# EAGLE design Qwiic-USB_Hub (EAGLE 9.6.2)
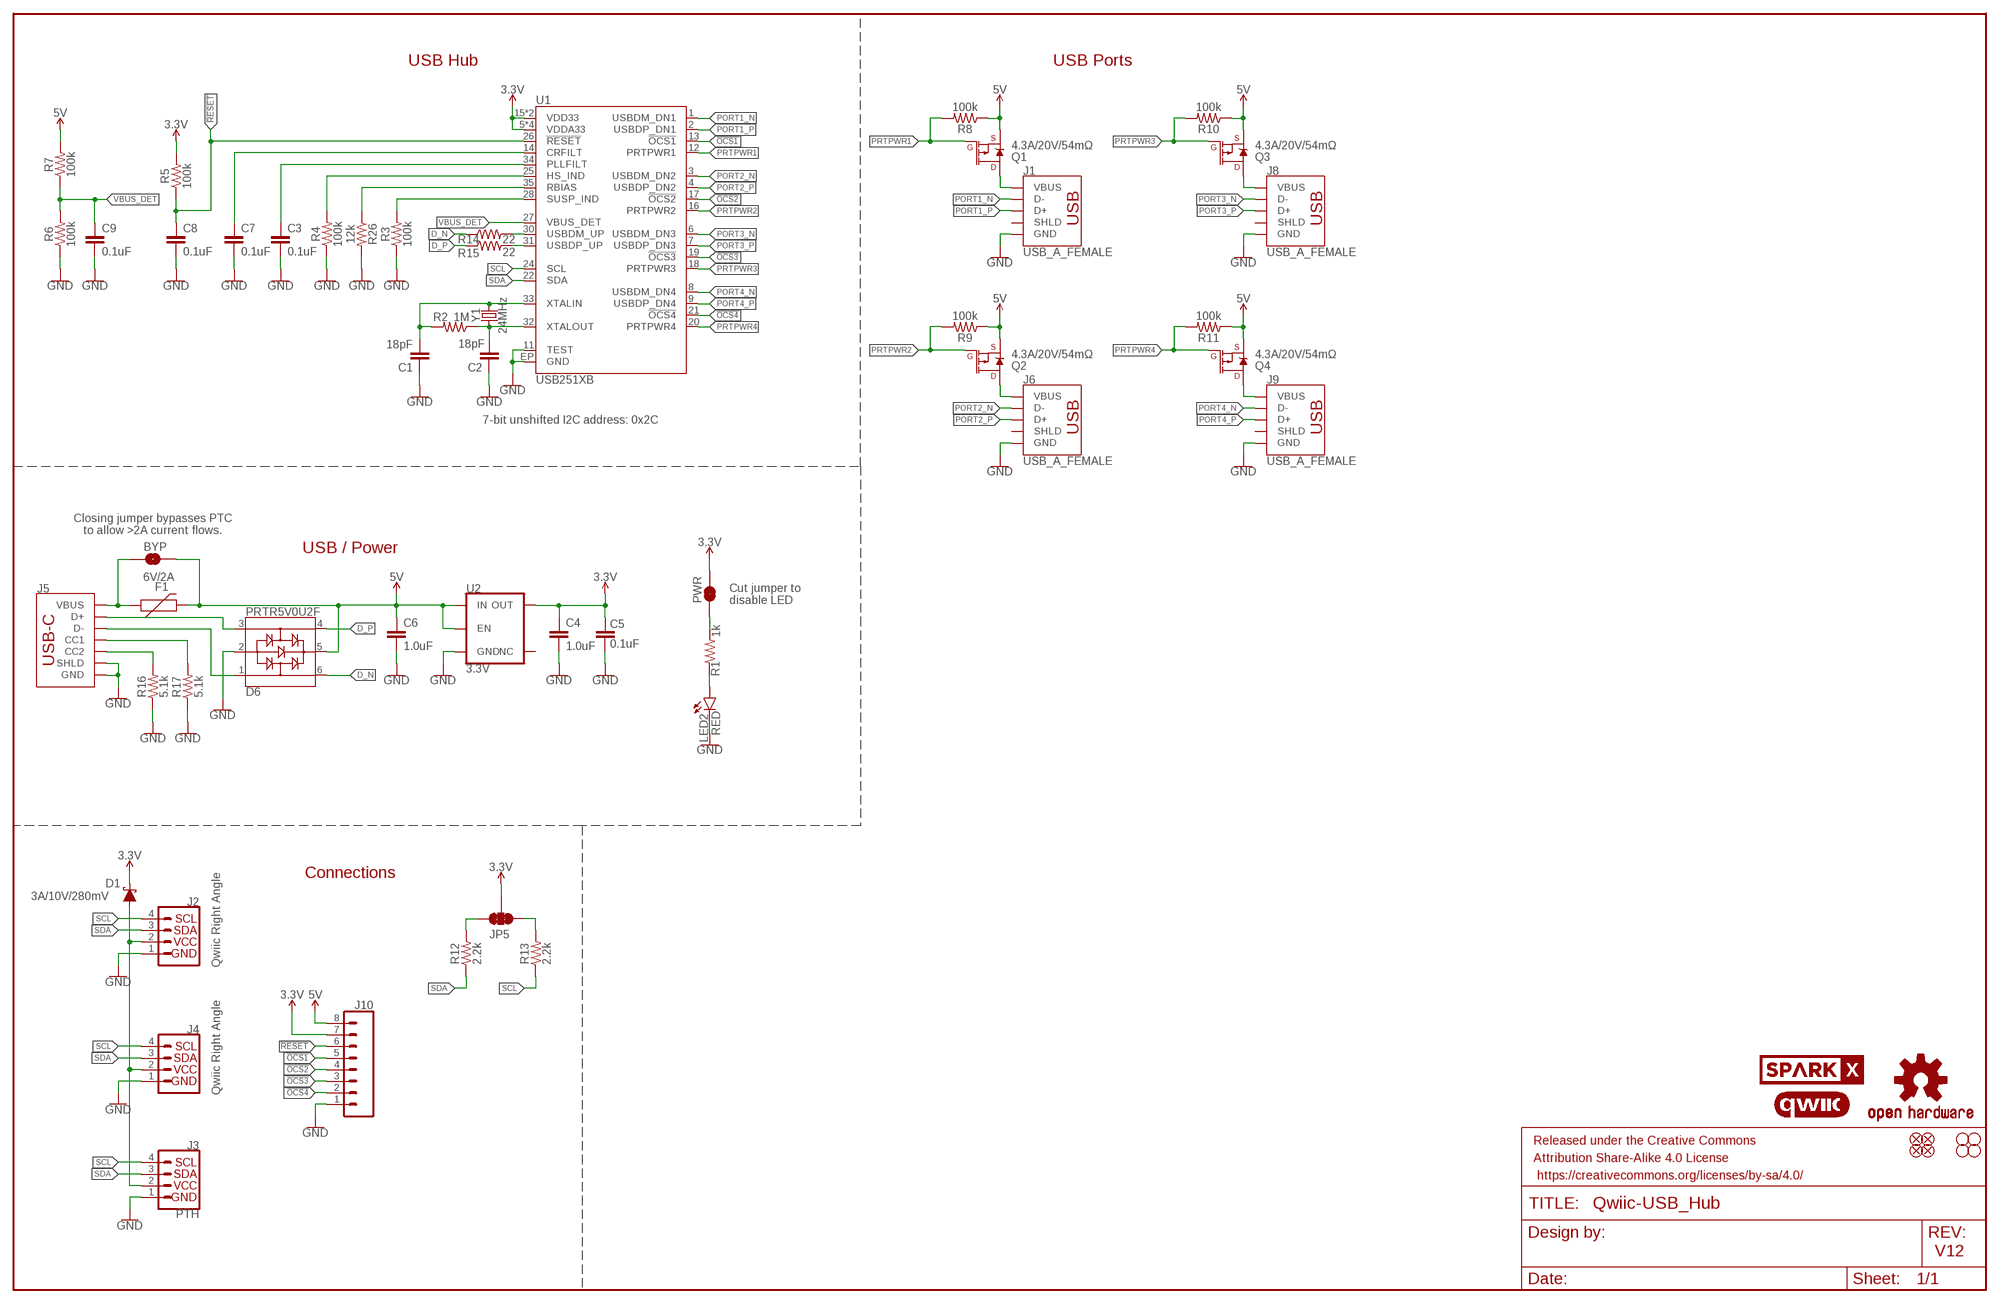
[diagram p0: schematic, sheet 1]

## Parts
BYP  JUMPER-SMT_2_NO_SILK  [SMT-JUMPER_2_NO_SILK]
C1  18pF  18PF-0603-50V-5%  [0603]
C2  18pF  18PF-0603-50V-5%  [0603]
C3  0.1uF  0.1UF-0603-25V-5%  [0603]
C4  1.0uF  1.0UF-0603-16V-10%-X7R  [0603]
C5  0.1uF  0.1UF-0603-25V-5%  [0603]
C6  1.0uF  1.0UF-0603-16V-10%-X7R  [0603]
C7  0.1uF  0.1UF-0603-25V-5%  [0603]
C8  0.1uF  0.1UF-0603-25V-5%  [0603]
C9  0.1uF  0.1UF-0603-25V-5%  [0603]
D1  3A/10V/280mV  DIODE-SCHOTTKY-BAT60A  [SOD-323]
D6  PRTR5V0U2F  [SOT886]
F1  6V/2A  PPTC_6V2A  [1210]
FRAME2  FRAME-LEDGER  [CREATIVE_COMMONS]
J1  USB_A_FEMALE  USB_A_SMT_FEMALE_NS  [USB-A-S-NOSILK-FEMALE]
J2  Qwiic Right Angle  I2C_STANDARDQWIIC  [JST04_1MM_RA]
J3  PTH  I2C_STANDARD_NO_SILK  [1X04_NO_SILK]
J4  Qwiic Right Angle  I2C_STANDARDQWIIC  [JST04_1MM_RA]
J5  USB_C_2-LAYER_PADS  [USB-C-16P-2LAYER-PADS]
J6  USB_A_FEMALE  USB_A_SMT_FEMALE_NS  [USB-A-S-NOSILK-FEMALE]
J8  USB_A_FEMALE  USB_A_SMT_FEMALE_NS  [USB-A-S-NOSILK-FEMALE]
J9  USB_A_FEMALE  USB_A_SMT_FEMALE_NS  [USB-A-S-NOSILK-FEMALE]
J10  CONN_08NO_SILK_FEMALE_PTH  [1X08_NO_SILK]
JP5  JUMPER-SMT_3_2-NC_TRACE_SILK  [SMT-JUMPER_3_2-NC_TRACE_SILK]
JP21  FIDUCIALUFIDUCIAL  [MICRO-FIDUCIAL]
JP31  STAND-OFF  [STAND-OFF]
JP41  STAND-OFF  [STAND-OFF]
JP61  FIDUCIALUFIDUCIAL  [MICRO-FIDUCIAL]
JP71  FIDUCIALUFIDUCIAL  [MICRO-FIDUCIAL]
JP81  FIDUCIALUFIDUCIAL  [MICRO-FIDUCIAL]
JP91  STAND-OFF  [STAND-OFF]
JP101  STAND-OFF  [STAND-OFF]
LED2  RED  LED-RED0603  [LED-0603]
LOGO1  OSHW-LOGOMINI  [OSHW-LOGO-MINI]
LOGO2  QWIIC_LOGO_CONNECTOR  [QWIIC_5.5MM]
PWR  JUMPER-SMT_2_NC_TRACE_SILK  [SMT-JUMPER_2_NC_TRACE_SILK]
Q1  4.3A/20V/54mΩ  MOSFET_PCH-IRLML2244  [SOT23-3]
Q2  4.3A/20V/54mΩ  MOSFET_PCH-IRLML2244  [SOT23-3]
Q3  4.3A/20V/54mΩ  MOSFET_PCH-IRLML2244  [SOT23-3]
Q4  4.3A/20V/54mΩ  MOSFET_PCH-IRLML2244  [SOT23-3]
R1  1k  1KOHM-0603-1/10W-1%  [0603]
R2  1M  1MOHM-0603-1/4W-5%  [0603]
R3  100k  100KOHM-0603-1/10W-1%  [0603]
R4  100k  100KOHM-0603-1/10W-1%  [0603]
R5  100k  100KOHM-0603-1/10W-1%  [0603]
R6  100k  100KOHM-0603-1/10W-1%  [0603]
R7  100k  100KOHM-0603-1/10W-1%  [0603]
R8  100k  100KOHM-0603-1/10W-1%  [0603]
R9  100k  100KOHM-0603-1/10W-1%  [0603]
R10  100k  100KOHM-0603-1/10W-1%  [0603]
R11  100k  100KOHM-0603-1/10W-1%  [0603]
R12  2.2k  2.2KOHM-0603-1/10W-1%  [0603]
R13  2.2k  2.2KOHM-0603-1/10W-1%  [0603]
R14  22  22OHM-0603-1/10W-1%  [0603]
R15  22  22OHM-0603-1/10W-1%  [0603]
R16  5.1k  5.1KOHM5.1KOHM-0603-1/10W-1%  [0603]
R17  5.1k  5.1KOHM5.1KOHM-0603-1/10W-1%  [0603]
R26  12k  12KOHM-0603-1/10W-1%  [0603]
U1  USB251XB  [QFN-36]
U2  3.3V  V_REG_AP2112K-3.3V  [SOT23-5]
U$5  SPARKX-LOGO4  [SPARKX-MEDIUM]
Y1  24MHz  CRYSTAL-24MHZ-SMD-2.0X1.6MM  [CRYSTAL-SMD-2.0X1.6MM]

## Nets
3.3V [3.3V]: C4.1 C5.2 D1.C J10.7 JP5.2 PWR.2 R5.2 U1.5(VDDA33) U1.10(VDDA33) U1.15(VDD33) U1.23(VDD33) U1.29(VDDA33) U1.36(VDDA33) U2.5(OUT)
5V: BYP.2 C6.1 D6.5 F1.2 J10.8 Q1.2(S) Q2.2(S) Q3.2(S) Q4.2(S) R7.2 R8.1 R9.1 R10.1 R11.1 U2.1(IN) U2.3(EN)
!OCS1: J10.5 U1.13(!OCS1)
!OCS2: J10.4 U1.17(!OCS2)
!OCS3: J10.3 U1.19(!OCS3)
!OCS4: J10.2 U1.21(!OCS4)
!RESET: C8.1 J10.6 R5.1 U1.26(!RESET)
CC1: J5.A5(CC1) R17.2
CC2: J5.B5(CC2) R16.2
D_N: D6.6 R14.1
D_P: D6.4 R15.1
GND: C1.1 C2.1 C3.2 C4.2 C5.1 C6.2 C7.2 C8.2 C9.2 D6.2 J1.GND J2.1 J3.1(GND) J4.1 J5.GND J5.GND2(GND) J5.SHLD1(SHLD) J5.SHLD2(SHLD) J5.SHLD3(SHLD) J5.SHLD4(SHLD) J6.GND J8.GND J9.GND J10.1 LED2.C R3.1 R4.1 R6.1 R16.1 R17.1 R26.2 U1.11(TEST) U1.EP(GND) U2.2(GND)
N$1: J1.VBUS Q1.3(D)
N$2: J6.VBUS Q2.3(D)
N$3: J8.VBUS Q3.3(D)
N$4: J9.VBUS Q4.3(D)
N$5: R26.1 U1.35(RBIAS)
N$6: C1.2 R2.2 U1.33(XTALIN) Y1.3
N$7: BYP.1 F1.1 J5.VBUS1(VBUS) J5.VBUS2(VBUS)
N$8: C2.2 R2.1 U1.32(XTALOUT) Y1.1
N$9: JP5.1 R13.2
N$10: LED2.A R1.1
N$11: R3.2 U1.28(SUSP_IND)
N$12: R4.2 U1.25(HS_IND)
N$13: C3.1 U1.34(PLLFILT)
N$14: C7.1 U1.14(CRFILT)
N$15: JP5.3 R12.2
N$16: R14.2 U1.30(USBDM_UP)
N$17: PWR.1 R1.2
N$18: R15.2 U1.31(USBDP_UP)
N$21 [3.3V]: D1.A J2.2 J3.2(VCC) J4.2
PORT1_N: J1.D- U1.1(USBDM_DN1)
PORT1_P: J1.D+ U1.2(USBDP_DN1)
PORT2_N: J6.D- U1.3(USBDM_DN2)
PORT2_P: J6.D+ U1.4(USBDP_DN2)
PORT3_N: J8.D- U1.6(USBDM_DN3)
PORT3_P: J8.D+ U1.7(USBDP_DN3)
PORT4_N: J9.D- U1.8(USBDM_DN4)
PORT4_P: J9.D+ U1.9(USBDP_DN4)
PRTPWR1: Q1.1(G) R8.2 U1.12(PRTPWR1)
PRTPWR2: Q2.1(G) R9.2 U1.16(PRTPWR2)
PRTPWR3: Q3.1(G) R10.2 U1.18(PRTPWR3)
PRTPWR4: Q4.1(G) R11.2 U1.20(PRTPWR4)
SCL: J2.4 J3.4(SCL) J4.4 R13.1 U1.24(SCL)
SDA: J2.3 J3.3(SDA) J4.3 R12.1 U1.22(SDA)
UNP_D+: D6.3 J5.A6(D+) J5.B6(D+)
UNP_D-: D6.1 J5.A7(D-) J5.B7(D-)
VBUS_DET: C9.1 R6.2 R7.1 U1.27(VBUS_DET)
Unconnected: J1.SHLD1(SHLD) J1.SHLD2(SHLD) J6.SHLD1(SHLD) J6.SHLD2(SHLD) J8.SHLD1(SHLD) J8.SHLD2(SHLD) J9.SHLD1(SHLD) J9.SHLD2(SHLD) U2.4(NC)

## Notes on the sheet
- USB Hub | USB Ports
- 7-bit unshifted I2C address: 0x2C
- Closing jumper bypasses PTC
  to allow >2A current flows.
- USB / Power
- Cut jumper to 
  disable LED
- Connections
- V12

## Library data of the parts
BYP = SparkFun-Jumpers:JUMPER-SMT_2_NO: Normally open jumper This jumper has two pads in close proximity to each other. Apply solder to close the connection. Round pads are easier to solder for beginners, but are a lot larger. SparkFun Product that uses the round pads: SparkFun EL Sequencer <https://www.sparkfun.com/products/12781>
C1 C2 = SparkFun-Capacitors:18PF: 18pF ceramic capacitors A capacitor is a passive two-terminal electrical component used to store electrical energy temporarily in an electric field.; PROD_ID: CAP-08267
C3 C5 C7-C9 = SparkFun-Capacitors:0.1UF: 0.1µF ceramic capacitors A capacitor is a passive two-terminal electrical component used to store electrical energy temporarily in an electric field.; PROD_ID: CAP-08604
C4 C6 = SparkFun-Capacitors:1.0UF: 1µF ceramic capacitors A capacitor is a passive two-terminal electrical component used to store electrical energy temporarily in an electric field.; PROD_ID: CAP-13930
D1 = SparkFun-DiscreteSemi:DIODE-SCHOTTKY: Schottky diode A Schottky diode is a semiconductor diode which has a low forward voltage drop and a very fast switching action.; PROD_ID: DIO-14072
D6 = SparkFun-IC-Power:PRTR5V0U2: A small ESD protection device. Most commonly used on USB D+/D- signals to protect large, expensive, or especially sensitive USB enabled devices.; PROD_ID: DIO-14084
F1 = SparkFun-Fuses:PPTC: Resettable Fuse PPTC Resettable Fuse. Really a sort of resistor with a polymeric positive temperature coefficient whose resistance increases dramatically with an increase in temperature. When heated by the power passing through the resistance rises causing the current to be limited, protecting the circuit. This is achieved by the transition of the polymer from a crystalline to an amorphous state where the conductive carbon separates breaking the conductive pathways found in the cool crystalline structure. When a PPTC cools back down it resumes conducting letting the circuit turn back on. SparkFun Products: SparkFun RedBoard - Programmed with Arduino <https://www.sparkfun.com/products/12757> Pro Micro - 5V/16MHz <https://www.sparkfun.com/products/12640> Arduino Pro 328 - 5V/16MHz <https://www.sparkfun.com/products/10915> MP3 Trigger <https://www.sparkfun.com/products/13720>; PROD_ID: RES-14313
FRAME2 = SparkFun-Aesthetics:FRAME-LEDGER: Schematic Frame - Ledger Standard 11x14 US Ledger frame
J1 J6 J8 J9 = SparkFun-Connectors:USB_A: USB-A Connector Male and female variants, as well as PTH and SMT variants SparkFun Products: SparkFun XBee Explorer Dongle <https://www.sparkfun.com/products/11697> PTH Male SparkFun MicroView-USB Programmer <https://www.sparkfun.com/products/12924> SMT Male SparkFun USB Type A Female Breakout <https://www.sparkfun.com/products/12700> SMT Female; PROD_ID: CONN-09520; SF_ID: PRT-09011
J2 J4 = SparkFun-Connectors:I2C_STANDARD: SparkFun I2C Standard Pinout Header SparkFun has standardized on a pinout for all I2C based sensor breakouts. This pinout allows I2C boards to be plugged directly into the headers on Arduino Uno compatible boards, and to be daisy chained easily. Example SparkFun Products: SparkFun Atmospheric Sensor Breakout - BME280 <https://www.sparkfun.com/products/13676> SparkFun Altitude/Pressure Sensor Breakout - MPL3115A2 <https://www.sparkfun.com/products/11084> SparkFun TOF Range Finder Sensor - VL6180 <https://www.sparkfun.com/products/12785>; PROD_ID: CONN-13694
J3 = SparkX:I2C_STANDARD: SparkFun I2C Standard Pinout Header SparkFun has standardized on a pinout for all I2C based sensor breakouts. This pinout allows I2C boards to be plugged directly into the headers on Arduino Uno compatible boards, and to be daisy chained easily. Example SparkFun Products: SparkFun Atmospheric Sensor Breakout - BME280 <https://www.sparkfun.com/products/13676> SparkFun Altitude/Pressure Sensor Breakout - MPL3115A2 <https://www.sparkfun.com/products/11084> SparkFun TOF Range Finder Sensor - VL6180 <https://www.sparkfun.com/products/12785>
J5 = SparkFun-Connectors:USB_C: USB Type C 16Pin Connector Super Speed pins not available on the 16-pin purely SMD connector so this part is best for USB 2.0 implementations. D1 and D2 are tied together enabling D+/- no matter which way the cable is plugged into the connector. The two channel configuration pins (CC1/2) are exposed. These are normally connected to ground via 5.1k resistors but can be reconfigured for high current/high power applications. **4-LAYER BOARD WARNING!!** If designing 4-layer board, make sure to select the variant _4-LAYER-ISOLATED. The linked footprint (USB-C-16-4LAYER-ISOLATED) includes some very necessary cutout polygons in the inner layers (2 and 15). This prevents the PTH mounting shield legs on the USB connector from electrically connecting any other polygons on the inner layers (usually VCC and GND).; PROD_ID: CONN-14122
J10 = SparkFun-Connectors:CONN_08: Multi connection point. Often used as Generic Header-pin footprint for 0.1 inch spaced/style header connections On any of the 0.1 inch spaced packages, you can populate with these: Break Away Headers - Straight <https://www.sparkfun.com/products/116> (PRT-00116) Break Away Male Headers - Right Angle <https://www.sparkfun.com/products/553> (PRT-00553) Female Headers <https://www.sparkfun.com/products/115> (PRT-00115) Break Away Headers - Machine Pin <https://www.sparkfun.com/products/117> (PRT-00117) Break Away Female Headers - Swiss Machine Pin <https://www.sparkfun.com/products/743> (PRT-00743) Arduino Stackable Header - 8 Pin <https://www.sparkfun.com/products/9279> (PRT-09279) For SCREWTERMINALS and SPRING TERMINALS visit here: Screw Terimnals on SparkFun.com <https://www.sparkfun.com/search/results?term=Screw+Terminals> (5mm/3.5mm/2.54mm spacing) This device is also useful as a general connection point to wire up your design to another part of your project. Our various solder wires solder well into these plated through hole pads. Hook-Up Wire - Assortment (Stranded, 22 AWG) <https://www.sparkfun.com/products/11375> (PRT-11375) Hook-Up Wire - Assortment (Solid Core, 22 AWG) <https://www.sparkfun.com/products/11367> (PRT-11367) View the entire wire category on our website here <https://www.sparkfun.com/categories/141> Special notes: Molex polarized connector foot print use with SKU : PRT-08231 with associated crimp pins and housings. 1MM SMD Version SKU: PRT-10208 NOTES ON THE VARIANTS LOCK and LOCK_LONGPADS... This footprint was designed to help hold the alignment of a through-hole component (i.e. 6-pin header) while soldering it into place. You may notice that each hole has been shifted either up or down by 0.005 of an inch from it's more standard position (which is a perfectly straight line). This slight alteration caused the pins (the squares in the middle) to touch the edges of the holes. Because they are alternating, it causes a "brace" to hold the component in place. 0.005 has proven to be the perfect amount of "off-center" position when using our standard breakaway headers. Although looks a little odd when you look at the bare footprint, once you have a header in there, the alteration is very hard to notice. Also,if you push a header all the way into place, it is covered up entirely on the bottom side.; PROD_ID: CONN-08438
JP5 = SparkFun-Jumpers:JUMPER-SMT_3_2-NC_TRACE: Normally closed trace jumper (2 of 2 connections) This jumper has a trace between all three pads so they are normally closed (NC). Use a razor knife to open the connection(s). For best results follow the IPC guidelines for cutting traces: Cutout at least 0.063 mm (0.005 in). Remove all loose material to clean up the cut area. Seal the cut with an approved epoxy. Reapply solder to reclose the connection(s).
JP21 JP61 JP71 JP81 = SparkFun:FIDUCIAL: Fiducial Alignment Points Various fiducial points for machine vision alignment.
JP31 JP41 JP91 JP101 = SparkFun:STAND-OFF: Stand Off This is the mechanical footprint for a #4 phillips button head screw. Use the keepout ring to avoid running the screw head into surrounding components. SKU : PRT-00447
LED2 = SparkFun-LED:LED-RED: Red SMD LED Used in manufacturing of most products at SparkFun Packages: 0603 - SMD 0603 package [Product Link] <http://docs.avagotech.com/docs/AV02-0551EN> 0603 SMART - SMD 0603 SMART package ( more efficient and expensive)[Product Link] <http://www.osram-os.com/Graphics/XPic2/00077099_0.pdf> 1206 - SMD1206 package [Product Link] <https://www.sparkfun.com/datasheets/DevTools/LilyPad/Q150OVS4.pdff> SparkFun Products: Pro Mini 328 -5V <https://www.sparkfun.com/products/821> RedBoard <https://www.sparkfun.com/products/12757> IOIO-OTG <https://www.sparkfun.com/products/13613>; PROD_ID: DIO-00819
LOGO1 = SparkFun-Aesthetics:OSHW-LOGO: Open-Source Hardware (OSHW) Logo This logo indicates the piece of hardware it is found on incorporates a OSHW license and/or adheres to the definition of open source hardware found here: http://freedomdefined.org/OSHW
LOGO2 = SparkFun-Aesthetics:QWIIC_LOGO: Qwiic Logos for placement on schematic and PCB. The 5.5mm silk logo is best for placing next to Qwiic connector.
PWR = SparkFun-Jumpers:JUMPER-SMT_2_NC_TRACE: Normally closed trace jumper This jumper has a trace between two pads so it's normally closed (NC). Use a razor knife to open the connection. For best results follow the IPC guidelines for cutting traces: Cutout at least 0.063 mm (0.005 in). Remove all loose material to clean up the cut area. Seal the cut with an approved epoxy. Reapply solder to reclose the connection.
Q1-Q4 = SparkFun-DiscreteSemi:MOSFET_PCH: P-channel MOSFETs Voltage controlled devices that allow control of high current outputs. SparkFun Products: SparkFun ESP32 Thing <https://www.sparkfun.com/products/13907> SparkFun ESP8266 Thing <https://www.sparkfun.com/products/13231> SparkFun Pi Servo HAT V2 <https://www.sparkfun.com/products/15316> DMG2305UX-7 (20V/4.2A/SOT23-3); PROD_ID: TRANS-11153
R1 = SparkFun-Resistors:1KOHM: 1kΩ resistor A resistor is a passive two-terminal electrical component that implements electrical resistance as a circuit element. Resistors act to reduce current flow, and, at the same time, act to lower voltage levels within circuits. - Wikipedia; PROD_ID: RES-07856
R2 = SparkFun-Resistors:1MOHM: 1MΩ resistor A resistor is a passive two-terminal electrical component that implements electrical resistance as a circuit element. Resistors act to reduce current flow, and, at the same time, act to lower voltage levels within circuits. - Wikipedia; PROD_ID: RES-07868
R3-R11 = SparkFun-Resistors:100KOHM: 100kΩ resistor A resistor is a passive two-terminal electrical component that implements electrical resistance as a circuit element. Resistors act to reduce current flow, and, at the same time, act to lower voltage levels within circuits. - Wikipedia; PROD_ID: RES-07828
R12 R13 = SparkFun-Resistors:2.2KOHM: 2.2kΩ resistor A resistor is a passive two-terminal electrical component that implements electrical resistance as a circuit element. Resistors act to reduce current flow, and, at the same time, act to lower voltage levels within circuits. - Wikipedia; PROD_ID: RES-08272
R14 R15 = SparkFun-Resistors:22OHM: 22Ω resistor A resistor is a passive two-terminal electrical component that implements electrical resistance as a circuit element. Resistors act to reduce current flow, and, at the same time, act to lower voltage levels within circuits. - Wikipedia; PROD_ID: RES-08698
R16 R17 = SparkFun-Resistors:5.1KOHM; PROD_ID: RES-12083
R26 = SparkFun-Resistors:12KOHM: 12kΩ resistor A resistor is a passive two-terminal electrical component that implements electrical resistance as a circuit element. Resistors act to reduce current flow, and, at the same time, act to lower voltage levels within circuits. - Wikipedia; PROD_ID: RES-10327
U1 = USB251xB:USB251XB; PROD_ID: IC-15827
U2 = SparkFun-IC-Power:V_REG_AP2112: AP2112 - 600mA CMOS LDO Regulator w/ Enable The AP2112 is CMOS process low dropout linear regulator with enable function, the regulator delivers a guaranteed 600mA (min.) continuous load current. Features Output Voltage Accuracy: ±1.5% Output Current: 600mA (Min.) Foldback Short Current Protection: 50mA Enable Function to Turn ON/OFF VOUT Low Dropout Voltage (3.3V): 250mV (Typ.) @IOUT=600mA Excellent Load Regulation: 0.2%/A (Typ.) Excellent Line Regulation: 0.02%/V (Typ.) Low Quiescent Current: 55μA (Typ.) Low Standby Current: 0.01μA (Typ.) Low Output Noise: 50μVRMS PSRR: 100Hz -65dB, 1kHz -65dB OTSD Protection Stable with 1.0μF Flexible Cap: Ceramic, Tantalum and Aluminum Electrolytic Operation Temperature Range: -40°C to 85°C ESD: MM 400V, HBM 4000V; PROD_ID: VREG-12457
U$5 = SparkX:SPARKX-LOGO
Y1 = SparkFun-Clocks:CRYSTAL-24MHZ: 24MHz Crystal Datasheet <http://www.sparkfun.com/datasheets/Components/AT-SMD-5x3.pdf> Frequency: 24MHz Frequency Tolerance: ±20ppm Load Capacitance: 12pF SparkFun Products: USB Bit Whacker <https://www.sparkfun.com/products/762>; PROD_ID: XTAL-14845

## Net classes
1 power: width 0.178 mm
2 3.3V: width 0.305 mm
3 RF: width 0.35 mm, clearance 0.203 mm

## Board
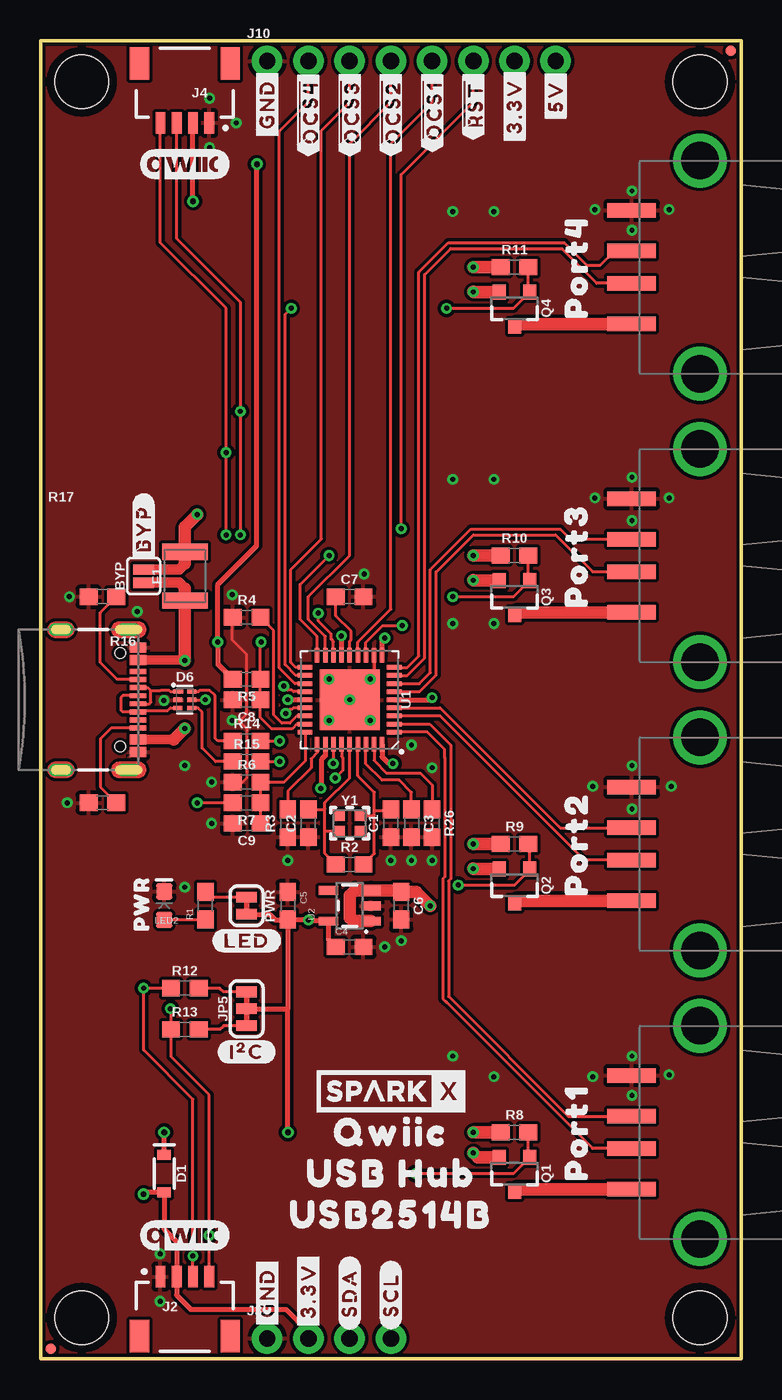
[diagram p1: board, top side]
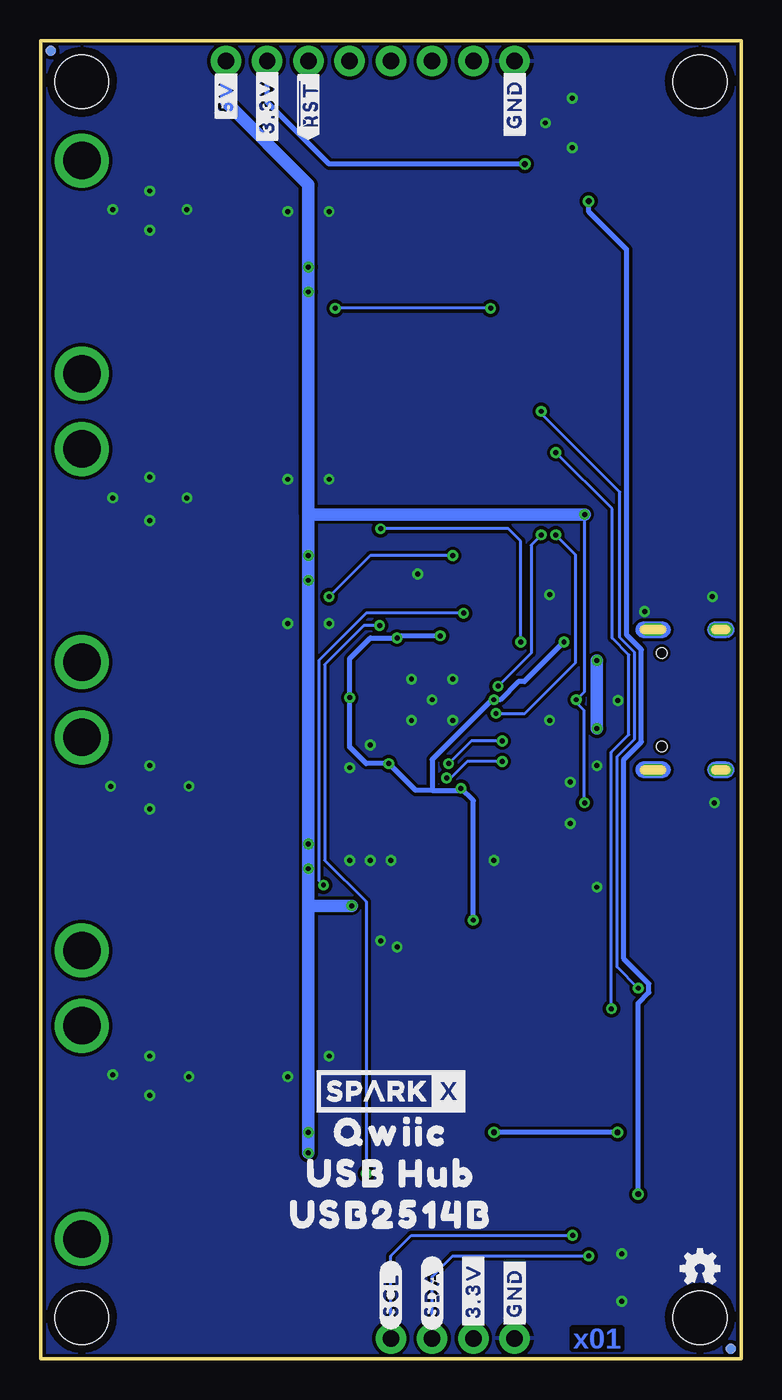
[diagram p2: board, bottom side, seen from below]

Size 43.18 x 81.28 mm. Coordinates in mm from the lower left corner, seen from the top.
Outline: 43.18,0 0,0 0,81.28 43.18,81.28 43.18,0
Copper layers (1*16): Top 0.035mm / dielectric 1.5mm / Bottom 0.035mm
Design rules "SparkFun-2-Layer-General-JLCPCB": minimum track width 7mil, minimum drill 0.3mm, track to track 7mil, track to pad 7mil, pad to pad 7mil, via to via 7mil, smd to smd 7mil, copper to edge 7mil, drill to drill 7mil, minimum pad ring 7mil, minimum via ring 7mil, stop-mask expansion 4mil, vias tented up to drill 25mil, thermal gap 10mil

### Footprints (pad centres in the part's own frame; a part is rotated, then mirrored left to right if it is on the bottom)
SMT-JUMPER_2_NO_SILK = smd 0.635 x 1.27: 1 -0.406,0; 2 0.406,0
0603 = smd 1.1 x 1: 1 -0.85,0; 2 0.85,0
SOD-323 = smd 0.63 x 0.83: A 1.15,0; C -1.15,0
SOT886 = smd 0.61 x 0.25: 1 -0.405,0.5 | smd 0.56 x 0.25: 2 -0.43,0; 3 -0.43,-0.5; 4 0.43,-0.5; 5 0.43,0; 6 0.43,0.5
1210 = smd 1 x 2.8: 1 -1.5,0; 2 1.5,0
USB-A-S-NOSILK-FEMALE = smd 3 x 0.9: D+ 6.752,-1; D- 6.752,1; GND 6.752,-3.5; VBUS 6.752,3.5 | drill 2.311: SHLD1 2.54,-6.566; SHLD2 2.54,6.566
JST04_1MM_RA = smd 0.6 x 1.35: 1 -1.5,0; 2 -0.5,0; 3 0.5,0; 4 1.5,0 | smd 1.2 x 2: NC1 2.8,-3.675; NC2 -2.8,-3.675
1X04_NO_SILK = drill 1.016 pad 1.88: 1 0,0; 2 2.54,0; 3 5.08,0; 4 7.62,0
USB-C-16P-2LAYER-PADS = smd 0.3 x 1: A5 -1.25,-0.34; A6 -0.25,-0.34; A7 0.25,-0.34; A8 1.25,-0.34; B5 1.75,-0.34; B6 0.75,-0.34; B7 -0.75,-0.34; B8 -1.75,-0.34 | smd 0.6 x 1: GND -3.225,-0.34; GND2 3.225,-0.34; VBUS1 -2.45,-0.34; VBUS2 2.45,-0.34 | drill 0.4 pad 0.6 long: SHLD1 -4.318,-0.915; SHLD2 4.318,-0.915; SHLD3 -4.318,-5.095; SHLD4 4.318,-5.095 | hole 0.65: -2.89,-1.445; 2.89,-1.445
1X08_NO_SILK = drill 1.016 pad 1.88: 1 0,0; 2 2.54,0; 3 5.08,0; 4 7.62,0; 5 10.16,0; 6 12.7,0; 7 15.24,0; 8 17.78,0
SMT-JUMPER_3_2-NC_TRACE_SILK = smd 0.66 x 1.27: 1 -1.041,0; 2 0,0; 3 1.041,0
MICRO-FIDUCIAL = smd 0.635 x 0.635: 1 0,0
STAND-OFF = hole 3.302: 0,0
LED-0603 = smd 1 x 1: A -0.877,0; C 0.877,0
SMT-JUMPER_2_NC_TRACE_SILK = smd 0.66 x 1.27: 1 -0.521,0; 2 0.521,0
SOT23-3 = smd 0.8 x 0.9: 1 -0.95,-1; 2 0.95,-1; 3 0,1.1
QFN-36 = smd 0.9 x 0.28: 1 -2.75,2; 2 -2.75,1.5; 3 -2.75,1; 4 -2.75,0.5; 5 -2.75,0; 6 -2.75,-0.5; 7 -2.75,-1; 8 -2.75,-1.5; 9 -2.75,-2; 19 2.75,-2; 20 2.75,-1.5; 21 2.75,-1; 22 2.75,-0.5; 23 2.75,0; 24 2.75,0.5; 25 2.75,1; 26 2.75,1.5; 27 2.75,2 | smd 0.28 x 0.9: 10 -2,-2.75; 11 -1.5,-2.75; 12 -1,-2.75; 13 -0.5,-2.75; 14 0,-2.75; 15 0.5,-2.75; 16 1,-2.75; 17 1.5,-2.75; 18 2,-2.75; 28 2,2.75; 29 1.5,2.75; 30 1,2.75; 31 0.5,2.75; 32 0,2.75; 33 -0.5,2.75; 34 -1,2.75; 35 -1.5,2.75; 36 -2,2.75 | smd 3.7 x 3.7: EP 0,0
SOT23-5 = smd 0.55 x 1.2: 1 -0.95,-1.3; 2 0,-1.3; 3 0.95,-1.3; 4 0.95,1.3; 5 -0.95,1.3
CRYSTAL-SMD-2.0X1.6MM = smd 0.75 x 0.7: 1 -0.675,-0.5; 2 0.675,-0.5; 3 0.675,0.5; 4 -0.675,0.5

### Placement (x,y rotation side)
BYP  6.35,48.26 90 top
C1  21.59,33.02 90 top
C2  16.51,33.02 90 top
C3  22.86,33.02 270 top
C4  19.05,25.4 0 top
C5  15.24,27.94 270 top
C6  22.23,27.94 270 top
C7  19.05,46.99 0 top
C8  12.7,40.64 180 top
C9  12.7,33.02 180 top
D1  7.62,11.43 270 top
D6  8.89,40.64 0 top
F1  8.89,48.26 90 top
FRAME2  -17.78,-26.67 0 top  (outside the outline)
J1  43.18,13.97 180 top
J2  8.89,5.08 0 top
J3  13.97,1.27 0 top
J4  8.89,76.2 180 top
J5  6.35,40.64 270 top
J6  43.18,31.75 180 top
J8  43.18,49.53 180 top
J9  43.18,67.31 180 top
J10  13.97,80.01 0 top
JP5  12.7,21.59 90 top
JP21  42.55,80.64 90 top
JP31  2.54,2.54 90 top
JP41  2.54,78.74 90 top
JP61  0.64,0.64 90 top
JP71  42.55,80.64 270 bottom
JP81  0.64,0.64 270 bottom
JP91  40.64,2.54 90 top
JP101  40.64,78.74 90 top
LED2  7.62,27.94 90 top
LOGO1  2.54,5.59 0 bottom
LOGO2  8.89,73.66 0 top
PWR  12.7,27.94 270 top
Q1  29.21,11.43 180 top
Q2  29.21,29.21 180 top
Q3  29.21,46.99 180 top
Q4  29.21,64.77 180 top
R1  10.16,27.94 90 top
R2  19.05,30.48 0 top
R3  15.24,33.02 90 top
R4  12.7,45.72 0 top
R5  12.7,41.91 180 top
R6  12.7,35.56 0 top
R7  12.7,34.29 180 top
R8  29.21,13.97 0 top
R9  29.21,31.75 0 top
R10  29.21,49.53 0 top
R11  29.21,67.31 0 top
R12  8.89,22.86 0 top
R13  8.89,20.32 0 top
R14  12.7,38.1 0 top
R15  12.7,36.83 0 top
R16  3.81,34.29 0 top
R17  3.81,46.99 0 top
R26  24.13,33.02 270 top
U1  19.05,40.64 180 top
U2  19.05,27.94 90 top
U$1  [PORT40]  33.02,67.31 90 top
U$2  [PORT31]  33.02,49.53 90 top
U$3  [PORT22]  33.02,31.75 90 top
U$4  [PORT13]  33.02,13.97 90 top
U$5  21.59,16.51 0 top
U$6  [#3#3V#0]  16.51,4.19 90 bottom
U$7  [#SDA#0]  19.05,4.06 90 bottom
U$8  [#SCL#0]  21.59,3.94 90 bottom
U$9  [#GND#0]  13.97,4.06 90 bottom
U$10  [#I�C#1]  12.7,18.92 0 top
U$11  [#GND#5]  13.97,77.34 90 bottom
U$12  [PWR0]  6.22,28.07 90 top
U$13  [##RST##4]  26.67,77.34 90 top
U$14  [#3#3V#6]  29.21,77.22 90 top
U$15  [#5V#7]  31.75,77.85 90 top
U$16  [#GND#5]  13.97,77.34 90 top
U$17  [##OCS1##3]  24.13,76.96 90 top
U$18  [##OCS2##2]  21.59,76.83 90 top
U$19  [##OCS3##1]  19.05,76.83 90 top
U$20  [##OCS4##0]  16.51,76.83 90 top
U$21  [#BYP#0]  6.35,51.18 90 top
U$22  [QWIIC2]  21.59,13.97 0 top
U$23  [#LED#0]  12.7,25.78 0 top
U$26  [USB2514B0]  21.59,8.89 0 top
U$27  [USB_HUB1]  21.59,11.43 0 top
U$31  [##RST##4]  26.67,77.34 90 bottom
U$32  [#3#3V#6]  29.21,77.22 90 bottom
U$33  [#GND#0]  13.97,4.06 90 top
U$34  [#3#3V#0]  16.51,4.19 90 top
U$35  [#SDA#0]  19.05,4.06 90 top
U$36  [#SCL#0]  21.59,3.94 90 top
U$37  [#5V#7]  31.75,77.85 90 bottom
U$38  SPARKX-LOGO4  [SPARKX-MEDIUM]  21.59,16.51 0 bottom
U$39  [QWIIC2]  21.59,13.97 0 bottom
U$40  [USB_HUB1]  21.59,11.43 0 bottom
U$41  [USB2514B0]  21.59,8.89 0 bottom
U$42  [QWIIC_5.5MM]  8.89,7.62 0 top
Y1  19.05,33.02 0 top

### Tracks (layer width: path | path; a pad name or v marks a point on that pad's centre or on a via)
3.3V  (via drill 0.3, 0.35)
  Top 0.305: C4.1 17.75,25.85 U2.5 16.57,26.99 v16.51,27.05 16.47,27.09 C5.2 15.24,27.05 | U1.23 v15.24,40.64 | v24.13,40.77 24.13,40.64 U1.5 | U1.29 17.55,37.19 17.31,36.95 17.31,35.22 v17.27,35.18 | U1.36 21.05,37.12 21.46,36.7 v21.72,36.7 | U1.10 21.05,44.29 v21.21,44.45 | U1.15 v18.55,44.57 v18.54,44.58 | R5.2 10.92,42.84 v10.92,44.2 10.92,47.75 13.31,50.14 13.31,73.64 v13.34,73.66 | 15.24,27.05 15.24,21.59 | JP5.2 15.24,21.59 | PWR.2 14.11,27.42 14.48,27.05 15.24,27.05 | D1.C v7.62,13.97 | v15.24,13.97 15.24,21.59
  Bottom 0.305: 19.05,35.05 17.4,35.05 v17.27,35.18 16.51,34.42 v16.51,27.05 | 19.05,35.05 20.07,35.05 v21.72,36.7 23.11,36.7 24.13,37.72 v24.13,40.77 24.13,43.18 22.86,44.45 v21.21,44.45 21.08,44.58 v18.54,44.58 | v10.92,44.2 13.36,41.76 13.74,41.76 14.85,40.64 v15.24,40.64 15.37,40.64 19.05,36.96 19.05,35.05 | J10.7 29.21,77.47 25.4,73.66 v13.34,73.66 | v7.62,13.97 v15.24,13.97
5V  (via drill 0.3)
  Top 0.178: D6.5 v10.16,40.64 | R7.2 v9.65,34.29
  Top 0.635: BYP.2 8.53,48.67 8.89,49.02
  Top 0.762: v9.65,52.07 9.65,52.05 8.89,51.28 F1.2 8.89,49.02 | R8.1 v26.67,13.97 | Q1.2 26.94,12.43 v26.67,12.7 | Q2.2 26.69,30.21 v26.67,30.23 | R9.1 v26.67,31.75 | R10.1 v26.67,49.53 | Q3.2 26.69,47.99 v26.67,48.01 | R11.1 v26.67,67.31 | Q4.2 26.69,65.77 v26.67,65.79 | v24,27.94 23.15,28.79 C6.1 22.12,28.89 U2.3 19.36,28.89 19.05,28.57 19.05,27.18 19.24,26.99 U2.1
  Bottom 0.178: 10.03,52.07 9.65,51.69 9.65,41.15 v10.16,40.64 10.16,40.47 9.69,40 9.69,34.33 v9.65,34.29
  Bottom 0.762: v9.65,52.07 10.03,52.07 26.67,52.07 | 26.67,52.07 v26.67,49.53 v26.67,48.01 v26.67,31.75 v26.67,30.23 26.67,27.94 | 26.67,27.94 v26.67,13.97 v26.67,12.7 | 26.67,52.07 v26.67,65.79 v26.67,67.31 26.67,72.39 31.75,77.47 J10.8 | v24,27.94 26.67,27.94
!OCS1
  Top 0.178: U1.13 19.55,44.19 21.59,46.23 21.59,74.93 24.13,77.47 J10.5
!OCS2
  Top 0.178: U1.17 17.55,44.55 16.51,45.59 16.51,46.99 19.05,49.53 19.05,74.93 21.59,77.47 J10.4
!OCS3
  Top 0.178: U1.19 15.74,42.64 15.43,42.95 15.43,48.67 17.31,50.55 17.31,75.73 19.05,77.47 J10.3
!OCS4
  Top 0.178: U1.21 15.67,41.64 14.72,42.59 14.72,75.68 16.51,77.47 J10.2
!RESET  (via drill 0.3)
  Top 0.178: v13.59,44.2 13.55,44.16 R5.1 C8.1 13.55,39.54 14.24,38.85 15.51,38.85 15.8,39.14 U1.26 | v22.23,51.18 22.23,73.03 26.67,77.47 J10.6
  Bottom 0.178: v13.59,44.2 13.59,50.42 14.35,51.18 v22.23,51.18
CC1
  Top 0.178: J5.A5 4.72,41.89 3.68,42.93 3.68,46.01 R17.2
CC2
  Top 0.178: J5.B5 4.35,38.89 3.68,38.23 3.68,35.27 R16.2
D_N
  Top 0.178: R14.1 10.92,38.1 10.76,38.27 10.76,40.89 10.41,41.24 9.82,41.24 9.72,41.14 D6.6
D_P
  Top 0.178: D6.4 9.7,40.14 9.96,39.88 9.96,37.66 10.79,36.83 R15.1
GND  (via drill 0.3)
  Top 0.178: U1.11 20.55,42.14 v20.32,41.91 | C8.2 11.56,40.64 | R4.1 11.81,45.68 11.81,44.32 12.7,43.43 12.7,39.75 12.32,39.37 v11.81,39.37 12.19,39.37 12.7,38.86 12.7,35.81 12.45,35.56 R6.1
  other vias: 15.24,30.73 8.89,29.08 21.59,30.73 22.86,30.73 24.13,30.73 22.23,25.78 21.21,25.4 34.04,17.4 36.45,18.67 38.73,17.53 36.45,16.26 7.37,3.56 7.37,6.48 36.45,33.91 36.45,36.58 38.86,35.31 34.04,35.31 36.45,51.69 36.45,54.36 38.73,53.09 34.16,53.09 36.45,69.6 36.45,72.01 38.73,70.87 34.16,70.87 10.41,74.68 10.41,77.72 12.06,76.2 19.94,48.39 19.05,40.64 17.78,41.91 20.32,39.37 17.78,39.37 11.81,47.12 5.96,46.07 8.89,36.58 1.65,34.29 1.78,46.99 7.6,40.6 10.54,35.56 10.54,33.02 22.86,37.85 24.13,36.45 25.4,45.34 27.94,45.34 25.4,54.23 27.94,54.23 25.4,18.67 27.94,17.4 27.94,70.74 25.4,70.74
  pour Top (isolate 0.203, rank 4): 0,0 0,81.28 43.18,81.28 43.18,0
  pour Bottom (isolate 0.203, rank 4): 0,0 0,81.28 43.18,81.28 43.18,0
N$1
  Top 0.762: J1.VBUS 29.35,10.47 Q1.3
N$2
  Top 0.762: J6.VBUS 29.35,28.25 Q2.3
N$3
  Top 0.762: J8.VBUS 29.35,46.03 Q3.3
N$4
  Top 0.762: J9.VBUS 29.35,63.81 Q4.3
N$5
  Top 0.178: R26.1 24.13,35.39 23.42,36.11 21.34,36.11 20.55,36.9 U1.35
N$6
  Top 0.178: U1.33 19.55,35.95 20.57,34.92 20.57,33.78 | R2.2 20.57,31.15 20.57,33.53 | 20.57,33.53 20.57,33.78 | C1.2 21.5,33.78 20.57,33.78 | Y1.3 20.57,33.52 20.57,33.53
N$7  (via drill 0.3)
  Top 0.597: J5.VBUS2 8.22,38.19 | J5.VBUS1 8.85,43.09
  Top 0.635: BYP.1 8.53,47.85 8.89,47.5
  Top 0.762: 8.89,47.5 F1.1 v8.89,43.05 8.85,43.09 | 8.22,38.19 v8.89,38.86
  Bottom 0.762: v8.89,38.86 v8.89,43.05
N$8
  Top 0.178: U1.32 19.05,35.82 17.53,34.29 17.53,33.91 | R2.1 17.53,31.15 17.53,32.51 | 17.53,32.51 17.53,33.91 | Y1.1 18.37,32.51 17.53,32.51 | C2.2 17.49,33.87 17.53,33.91
N$9
  Top 0.178: JP5.1 11.28,20.55 11.05,20.32 R13.2
N$10
  Top 0.178: R1.1 10.13,27.06 LED2.A
N$11
  Top 0.178: U1.28 17.05,37.38 16.67,37 16.67,36.44 15.24,35.01 R3.2
N$12
  Top 0.178: R4.2 14.37,44.9 14.37,39.7 14.87,39.2 15.36,39.2 15.79,39.64 U1.25
N$13
  Top 0.178: U1.34 20.05,36.68 21.04,35.69 22.1,35.69 22.86,34.92 C3.1
N$14
  Top 0.178: C7.1 18.2,45.81 19.14,44.87 19.14,44.33 19.05,44.24 U1.14
N$15
  Top 0.178: JP5.3 11.28,22.63 11.05,22.86 R12.2
N$16  (via drill 0.3)
  Top 0.178: U1.30 18.05,36.72 v18.03,36.7 | R14.2 v14.73,38.1
  Bottom 0.178: v14.73,38.1 16.64,38.1 v18.03,36.7
N$17
  Top 0.178: PWR.1 10.49,28.46 R1.2
N$18  (via drill 0.3)
  Top 0.178: R15.2 v14.73,36.83 | v18.16,35.81 18.63,36.28 18.63,37.08 18.55,37.16 U1.31
  Bottom 0.178: v14.73,36.83 16.89,36.83 17.91,35.81 v18.16,35.81
N$21  (via drill 0.35)
  Top 0.305: J3.2 16.51,1.65 15.11,3.05 9.27,3.05 8.39,3.93 J2.2 8.39,7.23 7.62,8 D1.A 6.47,10.28 v6.35,10.16 | v9.4,71.37 9.39,71.38 J4.2
  Bottom 0.305: v6.35,10.16 6.35,21.93 5.69,22.59 5.69,23.13 7.23,24.67 7.23,36.97 6.15,38.04 6.15,43.73 7.06,44.64 7.06,68.4 9.4,70.74 v9.4,71.37
PORT1_N
  Top 0.178: J1.D- 34.02,12.97 25.02,21.97 24.92,22.07 24.79,22.2 24.79,29.61 24.9,29.71 24.9,37.07 24.89,37.08 24.89,37.59 23.84,38.64 U1.1
PORT1_P
  Top 0.178: U1.2 23.98,39.14 25.27,37.85 25.27,29.58 25.15,29.46 25.15,22.35 32.52,14.97 J1.D+
PORT2_N
  Top 0.178: J6.D- 33.52,30.75 24.63,39.64 U1.3
PORT2_P
  Top 0.178: U1.4 24.63,40.14 32.02,32.75 J6.D+
PORT3_N
  Top 0.178: U1.6 23.36,41.14 24.38,42.16 24.38,48.51 26.67,50.8 31.75,50.8 34.02,48.53 J8.D-
PORT3_P
  Top 0.178: U1.7 23.35,41.64 24.03,42.32 24.03,48.66 26.52,51.16 32.03,51.16 32.64,50.55 35.31,50.55 35.56,50.8 36.16,50.8 J8.D+
PORT4_N
  Top 0.178: U1.8 22.61,42.14 23.67,43.2 23.67,66.85 25.27,68.45 32.13,68.45 34.27,66.31 J9.D-
PORT4_P
  Top 0.178: U1.9 22.61,42.64 23.32,43.35 23.32,67 25.13,68.81 32.28,68.81 33.65,67.43 34.5,67.43 35.38,68.31 J9.D+
PRTPWR1  (via drill 0.3)
  Top 0.178: U1.12 20.05,44.18 21.08,45.21 v22.29,45.21 | v23.11,11.43 29.16,11.43 Q1.1 30.06,12.53 R8.2
  Bottom 0.178: v22.29,45.21 23.25,45.21 25.67,42.8 25.67,30.75 23.11,28.19 v23.11,11.43
PRTPWR2  (via drill 0.3)
  Top 0.178: v25.74,29.21 29.21,29.21 30.16,30.16 Q2.1 30.16,31.65 R9.2 | U1.16 18.05,44.23 17.91,44.37 17.91,44.7 17.11,45.5 v17.11,45.97
  Bottom 0.178: v17.11,45.97 23.11,45.97 26.02,43.07 26.02,29.49 v25.74,29.21
PRTPWR3  (via drill 0.3)
  Top 0.178: U1.18 17.05,44.55 16,45.59 16,47.75 v17.78,49.53 | v25.4,46.99 29.16,46.99 Q3.1 30.06,48.09 R10.2
  Bottom 0.178: v17.78,49.53 22.86,49.53 v25.4,46.99
PRTPWR4  (via drill 0.3)
  Top 0.178: U1.20 15.74,42.14 15.08,42.8 15.08,64.4 v15.45,64.77 | v25.02,64.77 29.16,64.77 Q4.1 30.06,65.87 R11.2
  Bottom 0.178: v15.45,64.77 v25.02,64.77
SCL  (via drill 0.3)
  Top 0.178: U1.24 15.58,40.14 15.49,40.04 15.35,40.04 v15.11,39.8 | v11.43,50.8 v11.43,55.88 11.43,64.77 7.39,68.81 J4.4 | J2.4 v10.39,7.62 10.39,16.28 8.04,18.63 R13.1 8.04,21.55 v8,21.59
  Bottom 0.178: v15.11,39.8 13.33,39.8 10.2,42.93 10.2,49.57 v11.43,50.8 | J3.4 21.59,6.35 20.32,7.62 v10.39,7.62 | v8,21.59 8,37.41 6.93,38.49 6.93,43.41 7.96,44.44 7.96,52.41 v11.43,55.88
SDA  (via drill 0.3)
  Top 0.178: U1.22 15.58,41.14 15.49,41.24 15.23,41.24 v14.99,41.48 | J4.3 8.39,69.08 12.32,65.15 v12.32,58.42 v12.32,50.8 | J2.3 v9.39,6.35 9.39,16.01 6.35,19.05 v6.35,22.86 R12.1
  Bottom 0.178: v14.99,41.48 12.95,43.51 12.95,50.16 v12.32,50.8 | J3.3 19.05,5.08 17.78,6.35 v9.39,6.35 | v6.35,22.86 7.64,24.16 7.64,37.14 6.57,38.22 6.57,43.55 7.48,44.46 7.48,53.45 12.32,58.29 v12.32,58.42
UNP_D+
  Top 0.178: J5.A6 5.08,40.89 4.95,40.77 4.95,40.01 5.07,39.89 J5.B6 6.09,39.97 7.84,39.97 8,40.14 D6.3
UNP_D-
  Top 0.178: J5.A7 6.69,40.39 6.8,40.5 6.8,41.2 | J5.B7 6.61,41.39 6.8,41.2 | D6.1 8,41.14 7.91,41.24 7.41,41.24 7.38,41.2 6.8,41.2
VBUS_DET
  Top 0.178: U1.27 16.3,36.85 15.01,35.56 R6.2 R7.1 C9.1

### Text on the board
Bottom: x01
Measures: Measurements in inches